# Altium schematic sheet LiamCustomLegal.SchDoc
size Legal; Organization: Liam Herlihy; Address1: 375 S 3rs st, apt 115; Address2: Burbank, CA 91502
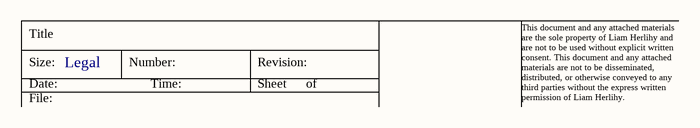
[diagram p0: LiamCustomLegal.SchDoc]

## Notes on the sheet
- Title
- Size:
- Date:
- Legal
- Number:
- Time:
- Revision:
- Sheet
- of
- File:
- This document and any attached materials are the sole property of Liam Herlihy and are not to be used without explicit written consent. This document and any attached materials are not to be disseminated, distributed, or otherwise conveyed to any third parties without the express written permission of Liam Herlihy.